# Altium project QCLogic Rev A.PrjPcb (part 2 of 2)
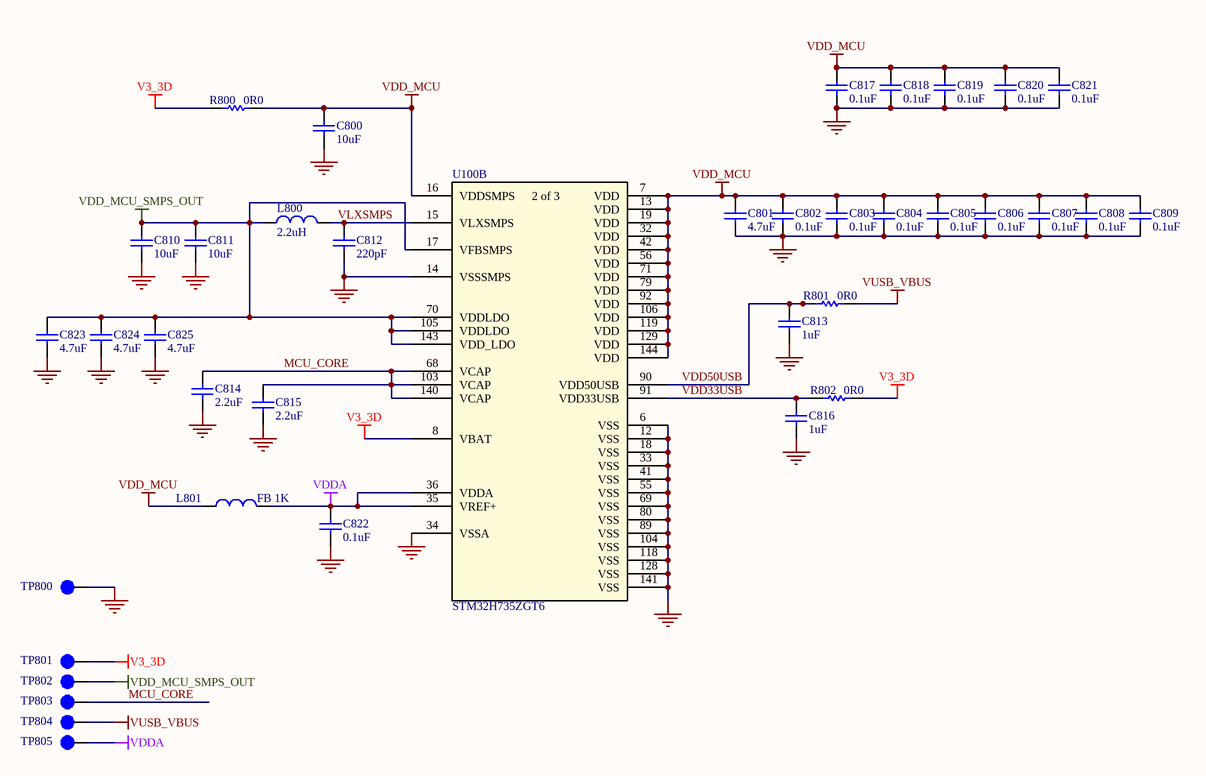
[diagram p9: QCLogic Rev A Sht8 MCU Power.SchDoc]

## Nets that join several sheets
GND: QCLogic Rev A Sht1 MCU IO (C100.1 R113.2), QCLogic Rev A Sht2 WiFi (16 pins), QCLogic Rev A Sht3 GPS (11 pins), QCLogic Rev A Sht4 QSPI Flash (C400.2 C401.2 TP407.1 U400.B3), QCLogic Rev A Sht5 MEMS (19 pins), QCLogic Rev A Sht6 Connector (7 pins), QCLogic Rev A Sht7 MCU CTRL (25 pins), QCLogic Rev A Sht8 MCU Power (42 pins)
V3_3D: QCLogic Rev A Sht2 WiFi (R200.2 R216.1), QCLogic Rev A Sht3 GPS (R300.1 R302.1), QCLogic Rev A Sht4 QSPI Flash (R403.2), QCLogic Rev A Sht5 MEMS (R500.1 R501.1 R524.1), QCLogic Rev A Sht6 Connector (7 pins), QCLogic Rev A Sht7 MCU CTRL (D703.1), QCLogic Rev A Sht8 MCU Power (R800.1 R802.2 TP801.1 U100.8)
VBAT: QCLogic Rev A Sht1 MCU IO (R112.1), QCLogic Rev A Sht6 Connector (J600.2)
VDD_MCU: QCLogic Rev A Sht7 MCU CTRL (5 pins), QCLogic Rev A Sht8 MCU Power (31 pins)
VUSB_VBUS: QCLogic Rev A Sht7 MCU CTRL (C700.2 D702.6 R705.2), QCLogic Rev A Sht8 MCU Power (R801.2 TP804.1)
BARO_CS: QCLogic Rev A Sht1 MCU IO (U100.131), QCLogic Rev A Sht5 MEMS (R520.1 TP513.1)
BARO_INT: QCLogic Rev A Sht1 MCU IO (U100.120), QCLogic Rev A Sht5 MEMS (R519.1 TP512.1)
BARO_MISO: QCLogic Rev A Sht1 MCU IO (U100.30), QCLogic Rev A Sht5 MEMS (R523.1 TP516.1)
BARO_MOSI: QCLogic Rev A Sht1 MCU IO (U100.29), QCLogic Rev A Sht5 MEMS (R522.1 TP515.1)
BARO_SCLK: QCLogic Rev A Sht1 MCU IO (U100.98), QCLogic Rev A Sht5 MEMS (R521.1 TP514.1)
BLDC_ARM1: QCLogic Rev A Sht1 MCU IO (U100.112), QCLogic Rev A Sht6 Connector (J600.34)
BLDC_ARM2: QCLogic Rev A Sht1 MCU IO (U100.108), QCLogic Rev A Sht6 Connector (J600.36)
BLDC_ARM3: QCLogic Rev A Sht1 MCU IO (U100.99), QCLogic Rev A Sht6 Connector (J600.38)
BLDC_ARM4: QCLogic Rev A Sht1 MCU IO (U100.97), QCLogic Rev A Sht6 Connector (J600.40)
BLDC_BOOTLOADER_RX1: QCLogic Rev A Sht1 MCU IO (U100.57), QCLogic Rev A Sht6 Connector (J600.25)
BLDC_BOOTLOADER_RX2: QCLogic Rev A Sht1 MCU IO (U100.138), QCLogic Rev A Sht6 Connector (J600.27)
BLDC_BOOTLOADER_RX3: QCLogic Rev A Sht1 MCU IO (U100.84), QCLogic Rev A Sht6 Connector (J600.29)
BLDC_BOOTLOADER_RX4: QCLogic Rev A Sht1 MCU IO (U100.75), QCLogic Rev A Sht6 Connector (J600.31)
BLDC_BOOTLOADER_TX1: QCLogic Rev A Sht1 MCU IO (U100.21), QCLogic Rev A Sht6 Connector (J600.18)
BLDC_BOOTLOADER_TX2: QCLogic Rev A Sht1 MCU IO (U100.139), QCLogic Rev A Sht6 Connector (J600.20)
BLDC_BOOTLOADER_TX3: QCLogic Rev A Sht1 MCU IO (U100.85), QCLogic Rev A Sht6 Connector (J600.22)
BLDC_BOOTLOADER_TX4: QCLogic Rev A Sht1 MCU IO (U100.74), QCLogic Rev A Sht6 Connector (J600.24)
BLDC_BOOTSEL1: QCLogic Rev A Sht1 MCU IO (U100.78), QCLogic Rev A Sht6 Connector (J600.26)
BLDC_BOOTSEL2: QCLogic Rev A Sht1 MCU IO (U100.81), QCLogic Rev A Sht6 Connector (J600.28)
BLDC_BOOTSEL3: QCLogic Rev A Sht1 MCU IO (U100.82), QCLogic Rev A Sht6 Connector (J600.30)
BLDC_BOOTSEL4: QCLogic Rev A Sht1 MCU IO (U100.83), QCLogic Rev A Sht6 Connector (J600.32)
BLDC_nRESET1: QCLogic Rev A Sht1 MCU IO (U100.113), QCLogic Rev A Sht6 Connector (J600.39)
BLDC_nRESET2: QCLogic Rev A Sht1 MCU IO (U100.115), QCLogic Rev A Sht6 Connector (J600.37)
BLDC_nRESET3: QCLogic Rev A Sht1 MCU IO (U100.116), QCLogic Rev A Sht6 Connector (J600.35)
BLDC_nRESET4: QCLogic Rev A Sht1 MCU IO (U100.117), QCLogic Rev A Sht6 Connector (J600.33)
BT_RXD: QCLogic Rev A Sht1 MCU IO (U100.38), QCLogic Rev A Sht2 WiFi (R209.1 TP211.1)
BT_TXD: QCLogic Rev A Sht1 MCU IO (U100.37), QCLogic Rev A Sht2 WiFi (R210.1 TP210.1)
CTRL_PWM1: QCLogic Rev A Sht1 MCU IO (U100.63), QCLogic Rev A Sht6 Connector (J600.17)
CTRL_PWM2: QCLogic Rev A Sht1 MCU IO (U100.64), QCLogic Rev A Sht6 Connector (J600.19)
CTRL_PWM3: QCLogic Rev A Sht1 MCU IO (U100.52), QCLogic Rev A Sht6 Connector (J600.21)
CTRL_PWM4: QCLogic Rev A Sht1 MCU IO (U100.53), QCLogic Rev A Sht6 Connector (J600.23)
EVENT_IN: QCLogic Rev A Sht1 MCU IO (U100.28), QCLogic Rev A Sht6 Connector (J600.16)
EXTRA1: QCLogic Rev A Sht1 MCU IO (U100.130), QCLogic Rev A Sht6 Connector (J600.14)
EXTRA2: QCLogic Rev A Sht1 MCU IO (U100.86), QCLogic Rev A Sht6 Connector (J600.11)
EXTRA3: QCLogic Rev A Sht1 MCU IO (U100.87), QCLogic Rev A Sht6 Connector (J600.13)
EXTRA4: QCLogic Rev A Sht1 MCU IO (U100.88), QCLogic Rev A Sht6 Connector (J600.15)
FLASH_NRESET: QCLogic Rev A Sht1 MCU IO (U100.2), QCLogic Rev A Sht4 QSPI Flash (R408.1 TP405.1)
GPS_EXTINT: QCLogic Rev A Sht1 MCU IO (U100.126), QCLogic Rev A Sht3 GPS (L307.1)
GPS_RESETN: QCLogic Rev A Sht1 MCU IO (U100.132), QCLogic Rev A Sht3 GPS (L309.1)
GPS_RXD: QCLogic Rev A Sht1 MCU IO (U100.72), QCLogic Rev A Sht3 GPS (L305.1)
GPS_SCL: QCLogic Rev A Sht1 MCU IO (U100.133), QCLogic Rev A Sht3 GPS (L304.1)
GPS_SDA: QCLogic Rev A Sht1 MCU IO (U100.134), QCLogic Rev A Sht3 GPS (L302.1)
GPS_TIME: QCLogic Rev A Sht1 MCU IO (U100.125), QCLogic Rev A Sht3 GPS (L308.1)
GPS_TXD: QCLogic Rev A Sht1 MCU IO (U100.73), QCLogic Rev A Sht3 GPS (L306.1)
IMU_AG_DEN: QCLogic Rev A Sht1 MCU IO (U100.3), QCLogic Rev A Sht5 MEMS (R505.1)
IMU_AG_INT1: QCLogic Rev A Sht1 MCU IO (U100.123), QCLogic Rev A Sht5 MEMS (R503.1 TP501.1)
IMU_AG_INT2: QCLogic Rev A Sht1 MCU IO (U100.122), QCLogic Rev A Sht5 MEMS (R504.1 TP502.1)
IMU_CS_AG: QCLogic Rev A Sht1 MCU IO (U100.136), QCLogic Rev A Sht5 MEMS (R511.1 TP509.1)
IMU_CS_MAG: QCLogic Rev A Sht1 MCU IO (U100.137), QCLogic Rev A Sht5 MEMS (R512.1 TP510.1)
IMU_INT_MAG: QCLogic Rev A Sht1 MCU IO (U100.124), QCLogic Rev A Sht5 MEMS (R502.1 TP500.1)
IMU_MAG_DRDY: QCLogic Rev A Sht1 MCU IO (U100.121), QCLogic Rev A Sht5 MEMS (R506.1 TP504.1)
IMU_SCL: QCLogic Rev A Sht1 MCU IO (U100.66), QCLogic Rev A Sht5 MEMS (R507.1 R517.2 TP505.1)
IMU_SDA: QCLogic Rev A Sht1 MCU IO (U100.67), QCLogic Rev A Sht5 MEMS (R508.1 R518.2 TP506.1)
IMU_SDO_AG: QCLogic Rev A Sht1 MCU IO (U100.4), QCLogic Rev A Sht5 MEMS (R509.1 TP507.1)
IMU_SDO_MAG: QCLogic Rev A Sht1 MCU IO (U100.5), QCLogic Rev A Sht5 MEMS (R510.1 TP508.1)
LED_B: QCLogic Rev A Sht1 MCU IO (U100.49), QCLogic Rev A Sht7 MCU CTRL (Q700.1 R709.1)
LED_G: QCLogic Rev A Sht1 MCU IO (U100.50), QCLogic Rev A Sht7 MCU CTRL (Q701.1 R710.1)
LED_R: QCLogic Rev A Sht1 MCU IO (U100.51), QCLogic Rev A Sht7 MCU CTRL (Q702.1 R711.1)
QSPI_CLK: QCLogic Rev A Sht1 MCU IO (U100.24), QCLogic Rev A Sht4 QSPI Flash (R402.1 TP400.1)
QSPI_CSN: QCLogic Rev A Sht1 MCU IO (U100.61), QCLogic Rev A Sht4 QSPI Flash (R409.1 TP406.1)
QSPI_IO0: QCLogic Rev A Sht1 MCU IO (U100.22), QCLogic Rev A Sht4 QSPI Flash (R404.1 TP401.1)
QSPI_IO1: QCLogic Rev A Sht1 MCU IO (U100.23), QCLogic Rev A Sht4 QSPI Flash (R405.1 TP402.1)
QSPI_IO2: QCLogic Rev A Sht1 MCU IO (U100.1), QCLogic Rev A Sht4 QSPI Flash (R406.1 TP403.1)
QSPI_IO3: QCLogic Rev A Sht1 MCU IO (U100.20), QCLogic Rev A Sht4 QSPI Flash (R407.1 TP404.1)
USB_D_N: QCLogic Rev A Sht1 MCU IO (R105.1), QCLogic Rev A Sht7 MCU CTRL (D702.2 J701.2)
USB_D_P: QCLogic Rev A Sht1 MCU IO (R106.1), QCLogic Rev A Sht7 MCU CTRL (D702.1 J701.3)
WIFI_CHIP_EN: QCLogic Rev A Sht1 MCU IO (U100.93), QCLogic Rev A Sht2 WiFi (R211.2 TP203.1)
WIFI_IRQN: QCLogic Rev A Sht1 MCU IO (U100.127), QCLogic Rev A Sht2 WiFi (R201.1 TP205.1)
WIFI_RESETN: QCLogic Rev A Sht1 MCU IO (U100.94), QCLogic Rev A Sht2 WiFi (R212.2 TP204.1)
WIFI_SDIO_CLK: QCLogic Rev A Sht1 MCU IO (R111.1), QCLogic Rev A Sht2 WiFi (R208.2 TP202.1)
WIFI_SDIO_CMD/SPI_SCLK: QCLogic Rev A Sht1 MCU IO (R100.1 R102.1), QCLogic Rev A Sht2 WiFi (R203.1 TP206.1)
WIFI_SDIO_DAT0/SPI_MISO: QCLogic Rev A Sht1 MCU IO (R103.1 R107.1), QCLogic Rev A Sht2 WiFi (R204.1 TP207.1)
WIFI_SDIO_DAT1/SPI_CS: QCLogic Rev A Sht1 MCU IO (R101.2 R108.1), QCLogic Rev A Sht2 WiFi (R205.1 TP208.1)
WIFI_SDIO_DAT2/SPI_MOSI: QCLogic Rev A Sht1 MCU IO (R104.1 R109.1), QCLogic Rev A Sht2 WiFi (R206.1 TP209.1)
WIFI_SDIO_DAT3: QCLogic Rev A Sht1 MCU IO (R110.1), QCLogic Rev A Sht2 WiFi (R207.2 TP201.1)
WIFI_SER_CFG: QCLogic Rev A Sht1 MCU IO (U100.48), QCLogic Rev A Sht2 WiFi (R202.2 TP200.1)